# EAGLE schematic HSTF 2018 - Eagle - V10 (EAGLE 8.5.2)

## Sheet 1 of 2
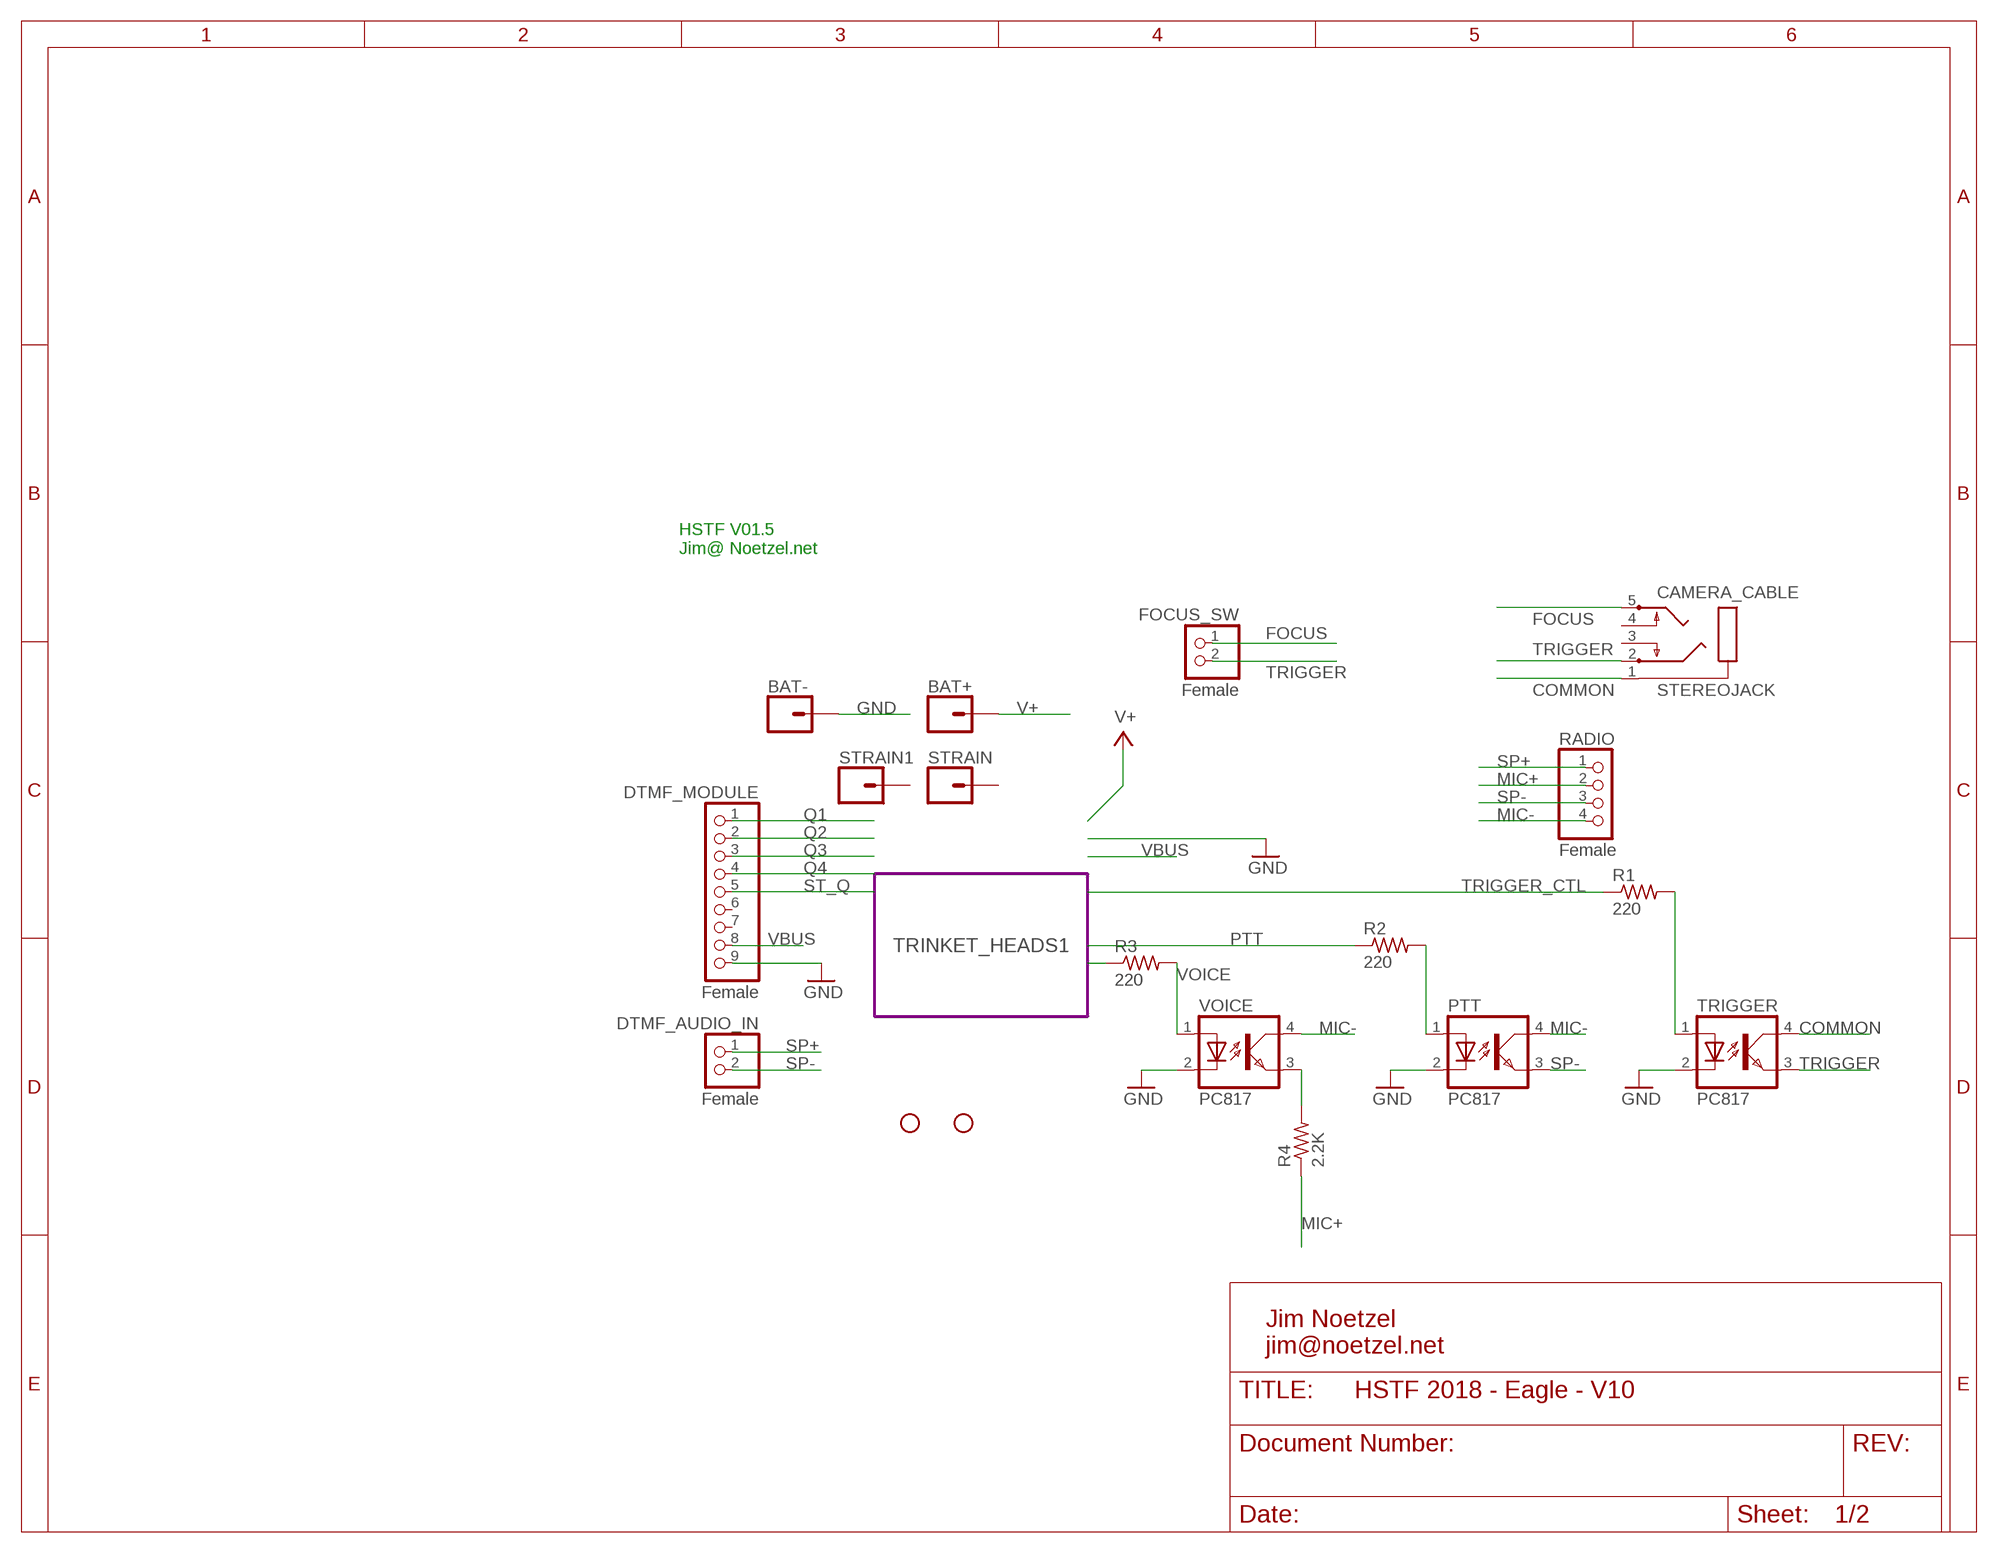
[diagram p0: schematic, sheet 1]

### Parts
BAT+  CONN_01PTH_2MM  [1X01_2MM]
BAT-  CONN_01PTH_2MM  [1X01_2MM]
CAMERA_CABLE  STEREOJACK  [STX3100]
DTMF_AUDIO_IN  Female  PINHD-1X2  [1X02]
DTMF_MODULE  Female  PINHD-1X9  [1X09]
FOCUS_SW  Female  PINHD-1X2  [1X02]
H1  STAND-OFFTIGHT  [STAND-OFF-TIGHT]
H2  STAND-OFF  [STAND-OFF]
PTT  PC817  [DIL04]
R1  220  R-US_0207/10  [0207/10]
R2  220  R-US_0207/10  [0207/10]
R3  220  R-US_0207/10  [0207/10]
R4  2.2K  R-US_0207/10  [0207/10]
RADIO  Female  PINHD-1X4  [1X04]
STRAIN  CONN_01PTH_2MM  [1X01_2MM]
STRAIN1  CONN_01PTH_2MM  [1X01_2MM]
TRIGGER  PC817  [DIL04]
VOICE  PC817  [DIL04]

### Module instances
TRINKET_HEADS1 = TRINKET_HEADS

### Nets
COMMON: CAMERA_CABLE.1 TRIGGER.4(COL)
FOCUS: CAMERA_CABLE.5 FOCUS_SW.1
GND: BAT-.1 DTMF_MODULE.9 PTT.2(C) TRIGGER.2(C) VOICE.2(C) ; also sheet 2
MIC+: R4.1 RADIO.2
MIC-: PTT.4(COL) RADIO.4 VOICE.4(COL)
N$9: R3.2 VOICE.1(A)
N$10: PTT.1(A) R2.2
N$12: R4.2 VOICE.3(EMIT)
OOPS: R1.2 TRIGGER.1(A)
PTT: R2.1 ; also sheet 2
Q1: DTMF_MODULE.1 ; also sheet 2
Q2: DTMF_MODULE.2 ; also sheet 2
Q3: DTMF_MODULE.3 ; also sheet 2
Q4: DTMF_MODULE.4 ; also sheet 2
SP+: DTMF_AUDIO_IN.1 RADIO.1
SP-: DTMF_AUDIO_IN.2 PTT.3(EMIT) RADIO.3
ST_Q: DTMF_MODULE.5 ; also sheet 2
TRIGGER: CAMERA_CABLE.2 FOCUS_SW.2 TRIGGER.3(EMIT)
TRIGGER_CTL: R1.1 ; also sheet 2
V+: BAT+.1 ; also sheet 2
VBUS: DTMF_MODULE.8 ; also sheet 2
VOICE: R3.1 ; also sheet 2
Unconnected: CAMERA_CABLE.3 CAMERA_CABLE.4 DTMF_MODULE.6 DTMF_MODULE.7 STRAIN1.1 STRAIN.1

### Notes on the sheet
- HSTF V01.5
  Jim@ Noetzel.net
- Jim Noetzel
  jim@noetzel.net

## Sheet 2 of 2
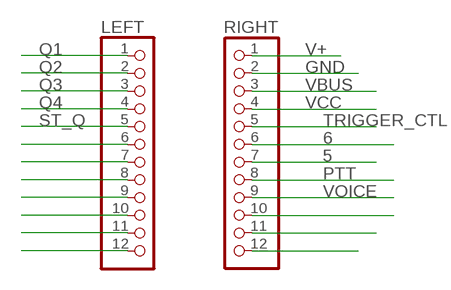
[diagram p1: schematic, sheet 2]

### Parts
LEFT  PINHD-1X12  [1X12]
RIGHT  PINHD-1X12  [1X12]

### Nets
5: RIGHT.7
6: RIGHT.6
GND: RIGHT.2 ; also sheet 1
N$1: LEFT.6
N$2: LEFT.7
N$3: LEFT.8
N$4: LEFT.9
N$5: LEFT.10
N$13: LEFT.11
N$14: LEFT.12
N$22: RIGHT.10
N$23: RIGHT.11
N$24: RIGHT.12
PTT: RIGHT.8 ; also sheet 1
Q1: LEFT.1 ; also sheet 1
Q2: LEFT.2 ; also sheet 1
Q3: LEFT.3 ; also sheet 1
Q4: LEFT.4 ; also sheet 1
ST_Q: LEFT.5 ; also sheet 1
TRIGGER_CTL: RIGHT.5 ; also sheet 1
V+: RIGHT.1 ; also sheet 1
VBUS: RIGHT.3 ; also sheet 1
VCC: RIGHT.4
VOICE: RIGHT.9 ; also sheet 1

## Library data of the parts
BAT+ BAT- STRAIN STRAIN1 = SparkFun-Connectors:CONN_01: Single connection point. Often used as Generic Header-pin footprint for 0.1 inch spaced/style header connections On any of the 0.1 inch spaced packages, you can populate with these: Break Away Headers - Straight <https://www.sparkfun.com/products/116> (PRT-00116) Break Away Male Headers - Right Angle <https://www.sparkfun.com/products/553> (PRT-00553) Female Headers <https://www.sparkfun.com/products/115> (PRT-00115) Break Away Headers - Machine Pin <https://www.sparkfun.com/products/117> (PRT-00117) Break Away Female Headers - Swiss Machine Pin <https://www.sparkfun.com/products/743> (PRT-00743) This device is also useful as a general connection point to wire up your design to another part of your project. Our various solder wires solder well into these plated through hole pads. Hook-Up Wire - Assortment (Stranded, 22 AWG) <https://www.sparkfun.com/products/11375> (PRT-11375) Hook-Up Wire - Assortment (Solid Core, 22 AWG) <https://www.sparkfun.com/products/11367> (PRT-11367) View the entire wire category on our website here <https://www.sparkfun.com/categories/141> Special notes: SMTSO-256-ET is a "flush mount" nut for a 4-40 screw. We mostly use this on specialty testbeds; it is a nice way to connect hardware to your PCB at an adjustable hieght. Also note, the SNAP packages are for using a snappable style connector. We sell a baggie of snaps and they are also used on two LilyPad designs: Snap Assortment - 30 pack (male and female) <https://www.sparkfun.com/products/11347> (DEV-11347) LilyPad Arduino SimpleSnap <https://www.sparkfun.com/products/10941> (DEV-10941) LilyPad SimpleSnap Protoboard <https://www.sparkfun.com/products/10940> (DEV-10940)
CAMERA_CABLE = adafruit:STEREOJACK: MIC/HEADPHONE JACK Stereo jack with two switches. Kycon STX3100, CUI SJ1-3555NG and/or 4UCon 05544
DTMF_AUDIO_IN FOCUS_SW = pinhead:PINHD-1X2: PIN HEADER
DTMF_MODULE = pinhead:PINHD-1X9: PIN HEADER
H1 H2 = SparkFun-Hardware:STAND-OFF: Stand Off Drill holes for mechanically mounting via screws, standoffs, etc. Note: Use the keepout ring to avoid running the screw head into surrounding components. Variant Overviews STAND-OFF - Mechanical footprint for a #4 phillips button head screw. STAND-OFF-TIGHT - Mechanical footprint for a #4 phillips button head screw, Example SparkFun Products Screw - Phillips Head (1/4", 4-40, 10 pack) <https://www.sparkfun.com/products/10453> (PRT-10453) Screw - Phillips Head (1/2", 4-40, 10 pack) <https://www.sparkfun.com/products/10452> (PRT-10452) Screw - Phillips Head (3/4", 4-40, 10 pack) <https://www.sparkfun.com/products/10451> (PRT-10451) Screw - Phillips Head (1", 4-40, 10 pack) <https://www.sparkfun.com/products/10450> (PRT-10450)
LEFT RIGHT = pinhead:PINHD-1X12: PIN HEADER; SPICEPREFIX: X
PTT TRIGGER VOICE = optocoupler:PC817: SHARP OPTO COUPLER; MPN: PC817X4J000F; OC_FARNELL: 9707727; OC_NEWARK: 97K7059
R1-R4 = adafruit:R-US_: RESISTOR, American symbol
RADIO = pinhead:PINHD-1X4: PIN HEADER

## Module TRINKET_HEADS
Ports: 

### Library data of the parts